# EAGLE design nanopi-black2-shield (EAGLE 9.6.2)
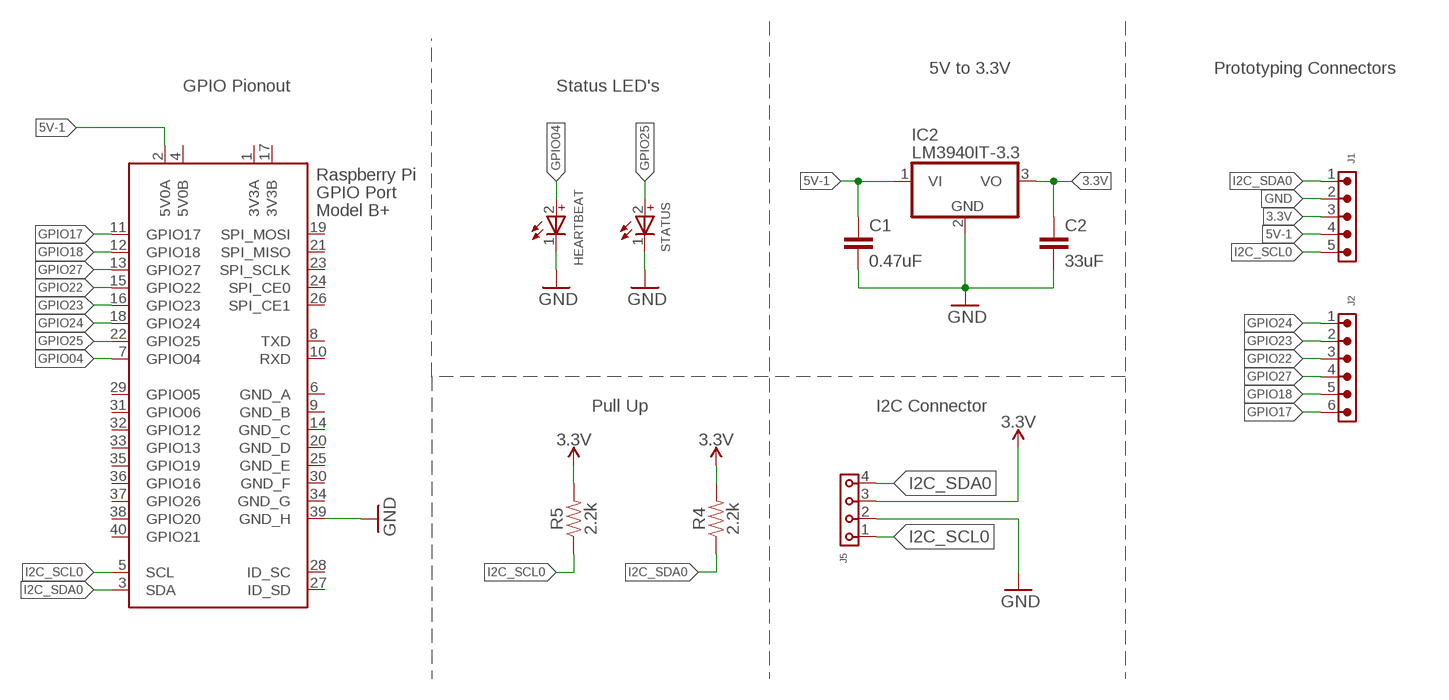
[diagram p0: schematic, sheet 1]

## Parts
C1  0.47uF  1.0UF-0603-16V-10%  [0603]
C2  33uF  C-EUC0805  [C0805]
HEARTBEAT  WL-SMSW_0603_REC_155060RS75300  [WL-SMSW_0603_REC]
IC2  LM3940IT-3.3  7818T  [TO220H]
J1  6130XX11121_61300511121  [61300511121]
J2  6130XX11121_61300611121  [61300611121]
J5  6130XX11821_61300411821  [61300411821]
R4  2.2k  2.2KOHM-0603-1/10W-1%  [0603]
R5  2.2k  2.2KOHM-0603-1/10W-1%  [0603]
STATUS  WL-SMSW_0603_REC_155060GS75300  [WL-SMSW_0603_REC]
X1  RASPI_BOARD_B+#_HDC  [RASPI_BOARD_B+HAT_DF_CF]

## Nets
3.3V [Power]: C2.1 IC2.3(VO) J1.3 J5.3 R4.2 R5.2
5V-1: C1.1 IC2.1(VI) J1.4 X1.2(5V0A)
GND: C1.2 C2.2 HEARTBEAT.1(-) IC2.2(GND) J1.2 J5.2 STATUS.1(-) X1.39(GND_H)
GPIO04: HEARTBEAT.2(+) X1.7(GPIO04)
GPIO17: J2.6 X1.11(GPIO17)
GPIO18: J2.5 X1.12(GPIO18)
GPIO22: J2.3 X1.15(GPIO22)
GPIO23: J2.2 X1.16(GPIO23)
GPIO24: J2.1 X1.18(GPIO24)
GPIO25: STATUS.2(+) X1.22(GPIO25)
GPIO27: J2.4 X1.13(GPIO27)
I2C_SCL0: J1.5 J5.1 R5.1 X1.5(SCL)
I2C_SDA0: J1.1 J5.4 R4.1 X1.3(SDA)
Unconnected: X1.8(TXD) X1.10(RXD) X1.19(SPI_MOSI) X1.21(SPI_MISO) X1.23(SPI_SCLK) X1.24(SPI_CE0) X1.26(SPI_CE1) X1.27(ID_SD) X1.28(ID_SC) X1.29(GPIO05) X1.31(GPIO06) X1.32(GPIO12) X1.33(GPIO13) X1.35(GPIO19) X1.36(GPIO16) X1.37(GPIO26) X1.38(GPIO20) X1.40(GPIO21)

## Notes on the sheet
- 5V to 3.3V | Prototyping Connectors
- GPIO Pionout | Status LED's
- Pull Up | I2C Connector

## Power pins joined to a net without a drawn wire
3V3A: X1.1(3V3A)
3V3B: X1.17(3V3B)
5V0B: X1.4(5V0B)
GND_A: X1.6(GND_A)
GND_B: X1.9(GND_B)
GND_C: X1.14(GND_C)
GND_D: X1.20(GND_D)
GND_E: X1.25(GND_E)
GND_F: X1.30(GND_F)
GND_G: X1.34(GND_G)

## Library data of the parts
C1 = SparkFun-Capacitors:1.0UF: 1µF ceramic capacitors A capacitor is a passive two-terminal electrical component used to store electrical energy temporarily in an electric field.; PROD_ID: CAP-00868; VALUE: 1.0uF
C2 = rcl:C-EU: CAPACITOR, European symbol; SPICEPREFIX: C
HEARTBEAT = 155060GS75300_Eagle_WL-SMSW_rev20b:WL-SMSW_0603_REC: WL-SMSW SMT Mono-color Side View Waterclear Characteristics High reliability Low current requirement No UV/IR radiation Wide viewing angle Excelllent for edge lighting LED displays and backlighting indicators Ideal for miniature applications Compatible with automatic placement equipment Applications Backlighting for LCD Sidelighting applications Indicator and backlighting for telecommunication Backlighting for symbols, switches and dashboards General LED lighting <https://www.we-online.com/catalog/media/o35735v209%20Family_WL-SMSW_1204_155124xx73200A.jpg> Details see: https://www.we-online.com/catalog/en/WL-SMSW/ Updated by Ella Wu, 2020-04-09 2020 (C) Wurth Elektronik; ABSTRAHLWINKEL: 140°; CHIP-TECHNOLOGY: AlInGaP; DATASHEET-URL: https://www.we-online.com/catalog/datasheet/155060RS75300.pdf; EMITTING-COLOR: Red; I-V-TYP: 150mcd; LAMDA-DOM-TYP: 625nm; LAMDA-PEAK-TYP: 625nm; PART-NUMBER: 155060RS75300; V-F-TYP: 2V
IC2 = linear:78*: Positive VOLTAGE REGULATOR Source: http://cache.national.com/ds/LM/LM78L05.pdf http://www.fairchildsemi.com/ds/LM/LM7805.pdf
J1 = 61300621821_Eagle_WR-PHD_rev19a:6130XX11121_61300511121: WR-PHD 2.54 mm THT Pin Header ARTICLE PROPERTIES: Pins:1;​ 2;​ 3;​ 4;​ 5;​ 6;​ 7;​ 8;​ 9;​ 10;​ 12;​ 13;​ 14;​ 15;​ 16;​ 18;​ 20;​ 22;​ 24;​ 25;​ 32;​ 36;​ 40 KIND PROPERTIES: Pitch：2.54 mm Quality Class:3 as per CECC 75 301-802 Rows：Single Gender：Pin Header Type：Straight MATERIAL PROPERTIES: Insulator Material :PBT Insulator Flammability Rating:UL94 V-0 Contact Material:Copper Alloy Contact Plating:Gold Contact Type:Stamped GENERAL INFORMATION Operating Temperature:-40 up to +105 °C Compliance:RoHS ELECTRICAL PROPERTIES: Rated Current:3 A IR 1:3 A Withstanding Voltage:500 V (AC) Contact Resistance:20 mΩ RISO:1000 MΩ CERTIFICATION UL Approval:E323964 PACKAGING PROPERTIES Packaging:Bag <https://katalog.we-online.com/media/images/v2/o33211v209%20Family_BTB_PHD_6130xx11121.jpg> Details see: https://katalog.we-online.com/en/em/PHD_2_54_THT_PIN_HEADER_6130XX11121 Updated by Yingchun,Shan 2019-10-16 2019 (C) Würth Elektronik; DATASHEET-URL: https://katalog.we-online.com/em/datasheet/61300511121.pdf; GENDER: Pin Header; IR: 3A; MATES: WR-PHD 2.54mm Angled Socket Header /SMT Socket Header/Socket Header; PACKAGING: Bag; PART-NUMBER: 61300511121; PINS: 5; ROWS: Single; TYPE: Straight
J2 = 61300621821_Eagle_WR-PHD_rev19a:6130XX11121_61300611121: WR-PHD 2.54 mm THT Pin Header ARTICLE PROPERTIES: Pins:1;​ 2;​ 3;​ 4;​ 5;​ 6;​ 7;​ 8;​ 9;​ 10;​ 12;​ 13;​ 14;​ 15;​ 16;​ 18;​ 20;​ 22;​ 24;​ 25;​ 32;​ 36;​ 40 KIND PROPERTIES: Pitch：2.54 mm Quality Class:3 as per CECC 75 301-802 Rows：Single Gender：Pin Header Type：Straight MATERIAL PROPERTIES: Insulator Material :PBT Insulator Flammability Rating:UL94 V-0 Contact Material:Copper Alloy Contact Plating:Gold Contact Type:Stamped GENERAL INFORMATION Operating Temperature:-40 up to +105 °C Compliance:RoHS ELECTRICAL PROPERTIES: Rated Current:3 A IR 1:3 A Withstanding Voltage:500 V (AC) Contact Resistance:20 mΩ RISO:1000 MΩ CERTIFICATION UL Approval:E323964 PACKAGING PROPERTIES Packaging:Bag <https://katalog.we-online.com/media/images/v2/o33211v209%20Family_BTB_PHD_6130xx11121.jpg> Details see: https://katalog.we-online.com/en/em/PHD_2_54_THT_PIN_HEADER_6130XX11121 Updated by Yingchun,Shan 2019-10-16 2019 (C) Würth Elektronik; DATASHEET-URL: https://katalog.we-online.com/em/datasheet/61300611121.pdf; GENDER: Pin Header; IR: 3A; MATES: WR-PHD 2.54mm Angled Socket Header /SMT Socket Header/Socket Header; PACKAGING: Bag; PART-NUMBER: 61300611121; PINS: 6; ROWS: Single; TYPE: Straight
J5 = 61300411121_Eagle_WR-PHD_rev19a:6130XX11821_61300411821: WR-PHD 2.54 mm Socket Header ARTICLE PROPERTIES: Pins:1;​ 2;​ 3;​ 4;​ 5;​ 6;​ 7;​ 8;​ 9;​ 10;​ 12;​ 13;​ 14;​ 15;​ 16;​ 18;​ 20;​ 22;​ 24;​ 25;​ 32;​ 36;​ 40 KIND PROPERTIES: Pitch：2.54 mm Quality Class:3 as per CECC 75 301-802 Rows：Single Gender：Socket Header;​ Female Type：Straight MATERIAL PROPERTIES: Insulator Material :PBT Insulator Flammability Rating:UL94 V-0 Contact Material:Copper Alloy Contact Plating:Gold Contact Type:Stamped GENERAL INFORMATION Operating Temperature:-40 up to +125 °C Compliance:Lead free / RoHS ELECTRICAL PROPERTIES: Rated Current:3 A IR 1:3 A Withstanding Voltage:500 V (AC) Contact Resistance:20 mΩ RISO:1000 MΩ CERTIFICATION UL Approval:E323964 PACKAGING PROPERTIES Packaging:Tray <https://katalog.we-online.com/media/images/v2/o33218v209%20Family_WR-PHD_613xxx11821.jpg> Details see: https://katalog.we-online.com/en/em/PHD_2_54_SOCKET_HEADER_6130XX11821 Updated by Yingchun,Shan 2019-10-21 2019 (C) Würth Elektronik; DATASHEET-URL: https://katalog.we-online.com/em/datasheet/61300411821.pdf; GENDER: Socket Header; IR: 3A; MATES: WR-PHD 2.54mm SMT Pin Header/THT Angled Pin Header/THT Pin Header; PACKAGING: Tray; PART-NUMBER: 61300411821; PINS: 4; ROWS: Single; TYPE: Straight
R4 R5 = SparkFun-Resistors:2.2KOHM: 2.2kΩ resistor A resistor is a passive two-terminal electrical component that implements electrical resistance as a circuit element. Resistors act to reduce current flow, and, at the same time, act to lower voltage levels within circuits. - Wikipedia; PROD_ID: RES-08272
STATUS = 155060GS75300_Eagle_WL-SMSW_rev20b:WL-SMSW_0603_REC: WL-SMSW SMT Mono-color Side View Waterclear Characteristics High reliability Low current requirement No UV/IR radiation Wide viewing angle Excelllent for edge lighting LED displays and backlighting indicators Ideal for miniature applications Compatible with automatic placement equipment Applications Backlighting for LCD Sidelighting applications Indicator and backlighting for telecommunication Backlighting for symbols, switches and dashboards General LED lighting <https://www.we-online.com/catalog/media/o35735v209%20Family_WL-SMSW_1204_155124xx73200A.jpg> Details see: https://www.we-online.com/catalog/en/WL-SMSW/ Updated by Ella Wu, 2020-04-09 2020 (C) Wurth Elektronik; ABSTRAHLWINKEL: 140°; CHIP-TECHNOLOGY: InGaN; DATASHEET-URL: https://www.we-online.com/catalog/datasheet/155060GS75300.pdf; EMITTING-COLOR: Green; I-V-TYP: 560mcd; LAMDA-DOM-TYP: 525nm; LAMDA-PEAK-TYP: 525nm; PART-NUMBER: 155060GS75300; V-F-TYP: 3.2V
X1 = raspberrypi_bastelstube_v13:RASPI_BOARD_B+#: Raspberry Pi GPIO connector with markings for the outer dimensions of the Raspberry Pi board model B+ with different sets of drill holes or mounting pads All pins connected

## Net classes
1 Power: width 0.305 mm

## Board
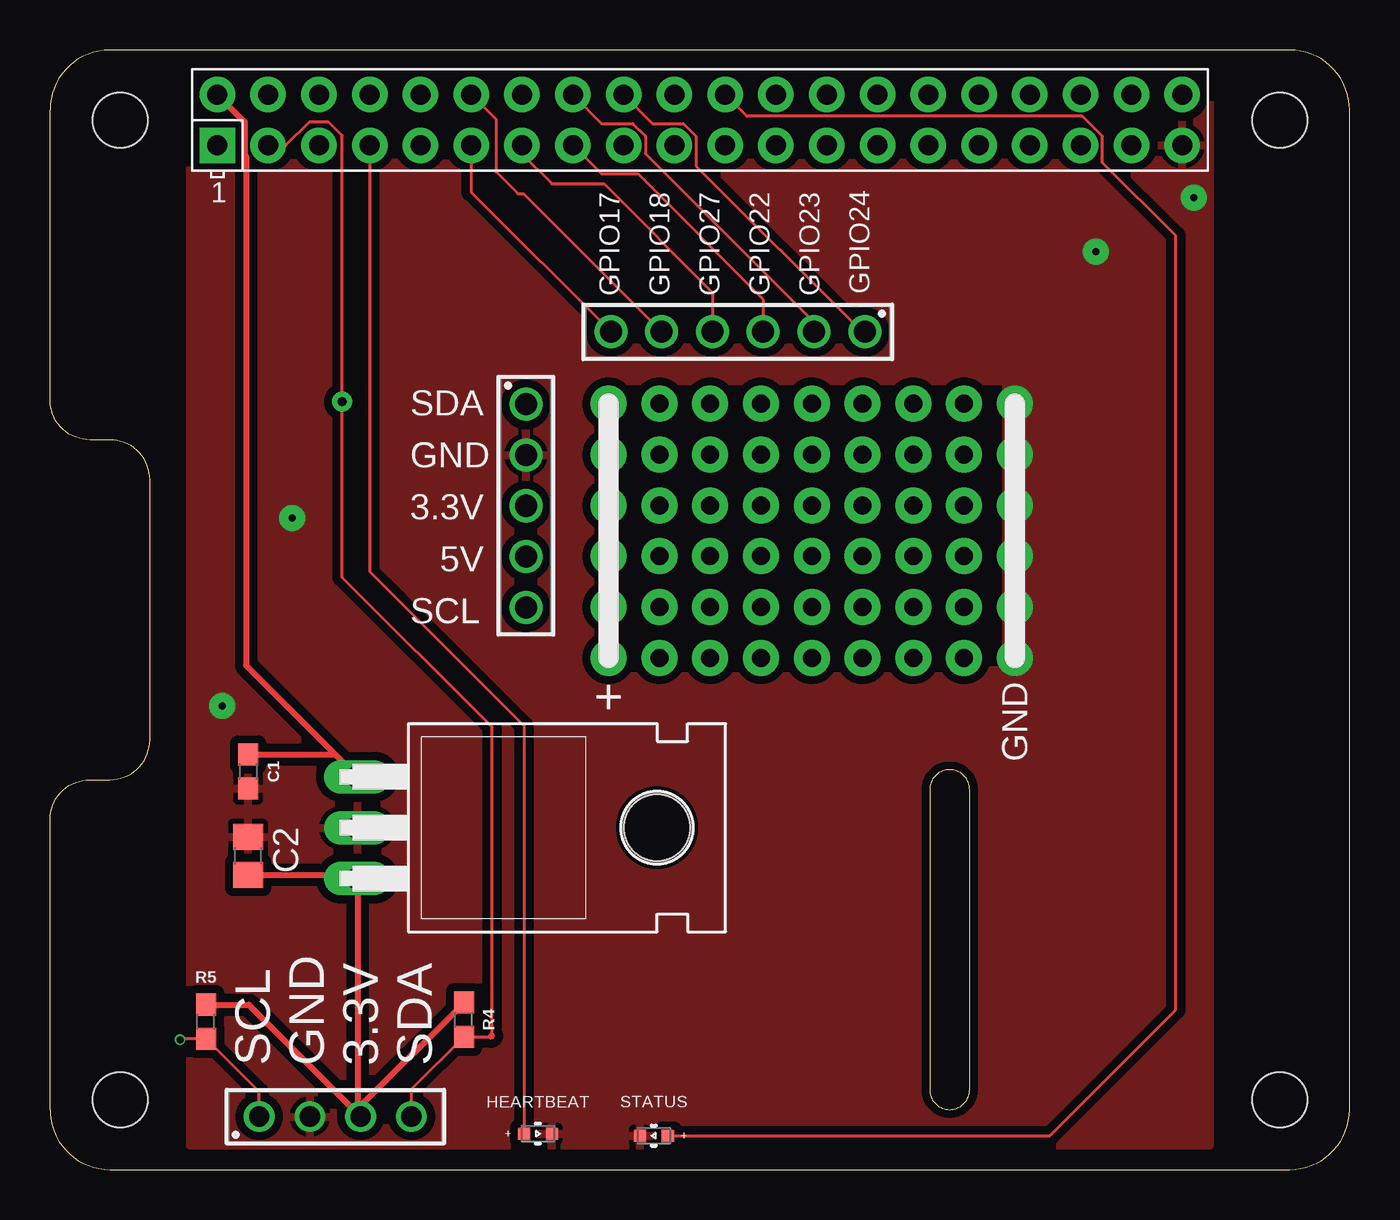
[diagram p1: board, top side]
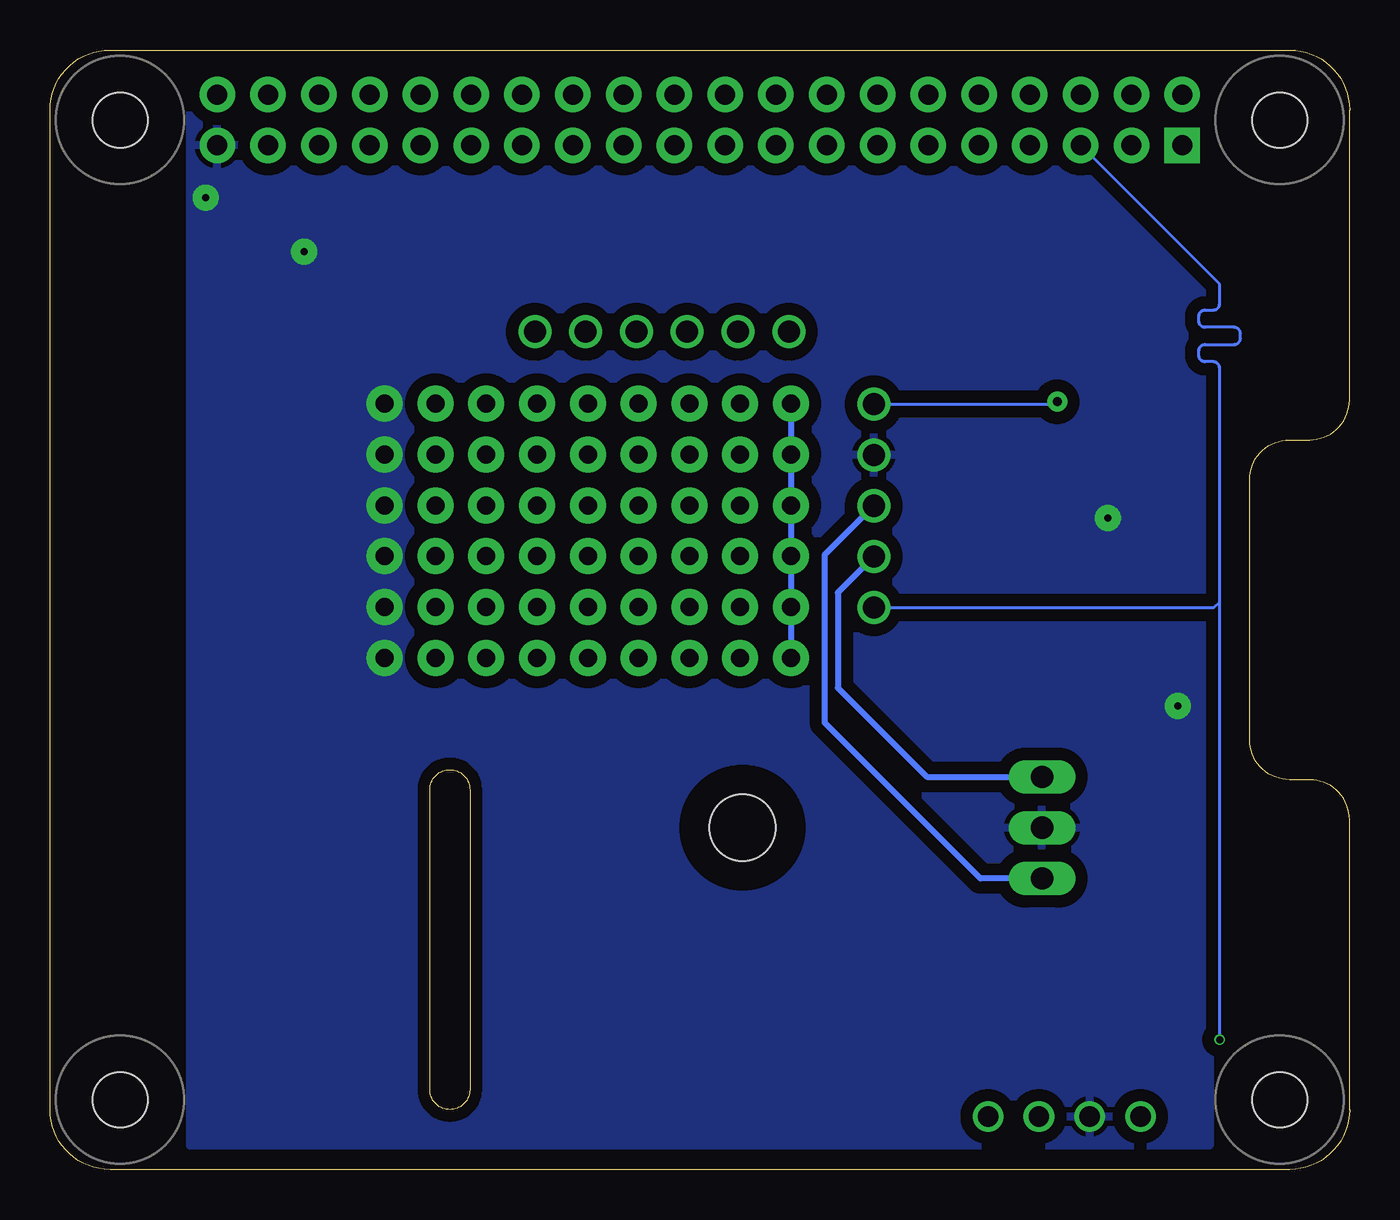
[diagram p2: board, bottom side, seen from below]

Size 65 x 56 mm. Coordinates in mm from the lower left corner, seen from the top.
Copper layers (1*16): Top 0.035559375mm / dielectric 1.6mm / Bottom 0.035559375mm
Design rules "jlcpcb2layer": minimum track width 5mil, minimum drill 12mil, track to track 5mil, track to pad 5mil, pad to pad 5mil, via to via 5mil, smd to smd 5mil, copper to edge 8mil, drill to drill 6mil, minimum pad ring 5mil, minimum via ring 3mil, stop-mask expansion 2.5mil, vias tented up to drill 0mil, thermal gap 10mil

### Footprints (pad centres in the part's own frame; a part is rotated, then mirrored left to right if it is on the bottom)
0603 = smd 1.1 x 1: 1 -0.85,0; 2 0.85,0
C0805 = smd 1.3 x 1.5: 1 -0.95,0; 2 0.95,0
WL-SMSW_0603_REC = smd 0.6 x 0.6: 1 -0.7,0; 2 0.7,0
TO220H = drill 1.118 long: 1 -2.54,-10.16; 2 0,-10.16; 3 2.54,-10.16 | hole 3.302: 0,4.826
61300511121 = drill 1.1: 1 -5.08,0; 2 -2.54,0; 3 0,0; 4 2.54,0; 5 5.08,0
61300611121 = drill 1.1: 1 -6.35,0; 2 -3.81,0; 3 -1.27,0; 4 1.27,0; 5 3.81,0; 6 6.35,0
61300411821 = drill 1.02: 1 -3.81,0; 2 -1.27,0; 3 1.27,0; 4 3.81,0
RASPI_BOARD_B+HAT_DF_CF = drill 1 pad 1.778 square: 1 8.37,51.23 | drill 1 pad 1.778: 2 8.37,53.77; 3 10.91,51.23; 4 10.91,53.77; 5 13.45,51.23; 6 13.45,53.77; 7 15.99,51.23; 8 15.99,53.77; 9 18.53,51.23; 10 18.53,53.77; 11 21.07,51.23; 12 21.07,53.77; 13 23.61,51.23; 14 23.61,53.77; 15 26.15,51.23; 16 26.15,53.77; 17 28.69,51.23; 18 28.69,53.77; 19 31.23,51.23; 20 31.23,53.77; 21 33.77,51.23; 22 33.77,53.77; 23 36.31,51.23; 24 36.31,53.77; 25 38.85,51.23; 26 38.85,53.77; 27 41.39,51.23; 28 41.39,53.77; 29 43.93,51.23; 30 43.93,53.77; 31 46.47,51.23; 32 46.47,53.77; 33 49.01,51.23; 34 49.01,53.77; 35 51.55,51.23; 36 51.55,53.77; 37 54.09,51.23; 38 54.09,53.77; 39 56.63,51.23; 40 56.63,53.77 | hole 2.75: 3.5,3.5; 3.5,52.5; 61.5,3.5; 61.5,52.5

### Placement (x,y rotation side)
C1  9.9,19.91 270 top
C2  9.91,15.69 90 top
HEARTBEAT  24.4,1.8 180 top
IC2  25.54,17.1 270 top
J1  23.8,33.2 270 top
J2  34.4,41.9 180 top
J5  14.27,2.65 0 top
R4  20.7,7.5 90 top
R5  7.8,7.4 90 top
STATUS  30.2,1.7 0 top
X1  0,0 0 top

### Tracks (layer width: path | path; a pad name or v marks a point on that pad's centre or on a via)
3.3V
  Top 0.305: C2.1 15.2,14.74 IC2.3 15.38,2.81 J5.3 | R5.2 9.94,8.25 J5.3 | R4.2 15.54,3.19 J5.3
  Bottom 0.305: IC2.3 18.46,14.56 26.24,22.34 26.24,30.76 J1.3
5V-1
  Top 0.305: X1.2 9.74,52.4 9.74,50.75 9.8,50.69 9.8,25.22 IC2.1 14.26,20.76 C1.1
  Bottom 0.305: J1.4 25.6,28.86 25.6,24.1 21.14,19.64 IC2.1
GND  (via drill 0.35 pad 1.3, 0.9 pad 1.8)
  other vias: 48.26,38.3 48.26,35.76 48.26,33.22 48.26,30.68 48.26,28.14 48.26,25.6 8.6,23.2 12.1,32.6 52.3,45.9 57.2,48.6
  pour Top (isolate 0.406): 7,55.2 58,55.2 58,1.2 7,1.2
  pour Bottom (isolate 0.61): 7,55.2 7,1.2 58,1.2 58,55.2
  cutout Top (isolate 0.305): 28,39.2 28,25.2 47.6,25.2 47.6,39.2
GPIO04
  Top 0.152: X1.7 15.99,29.91 23.7,22.2 HEARTBEAT.2
GPIO17
  Top 0.152: X1.11 21.07,48.88 J2.6
GPIO18
  Top 0.152: X1.12 22.3,52.54 22.3,49.9 23.4,48.8 23.69,48.8 J2.5
GPIO22
  Top 0.152: X1.15 27.58,49.8 29.4,49.8 35.67,43.53 J2.3
GPIO23
  Top 0.152: X1.16 27.6,52.32 29.14,52.32 29.78,51.68 29.78,50.82 38.21,42.39 J2.2
GPIO24
  Top 0.152: X1.18 30.14,52.32 31.68,52.32 32.32,51.68 32.32,50.18 40.6,41.9 J2.1
GPIO25
  Top 0.152: STATUS.2 50,1.7 56.3,8 56.3,46.7 52.64,50.36 52.64,51.68 51.65,52.68 34.86,52.68 X1.22
GPIO27
  Top 0.152: X1.13 23.61,50.79 25.1,49.3 27.7,49.3 33.13,43.87 J2.4
I2C_SCL0  (via drill 0.35)
  Top 0.152: J5.1 10.46,3.89 R5.1 6.55,6.55
  Top 0.305: 6.55,6.55 v6.5,6.5
  Bottom 0.152: v6.5,6.5 6.5,28.4 | 6.5,28.4 6.5,40.09 arc-90 6.81,40.41 7.23,40.41 arc90 7.54,40.72 7.54,40.96 arc90 7.23,41.27 5.77,41.27 arc-90 5.46,41.58 5.46,41.82 arc-90 5.77,42.13 7.23,42.13 arc90 7.54,42.44 7.54,42.68 arc90 7.23,42.99 6.81,42.99 arc-90 6.5,43.3 6.5,44.28 X1.5 | J1.5 6.78,28.12 6.5,28.4
I2C_SDA0  (via drill 0.45 pad 1)
  Top 0.152: J5.4 18.08,4.03 R4.1 22.05,6.65 | X1.3 11.8,51.23 12.97,52.4 13.93,52.4 14.62,51.71 v14.62,38.4 14.62,29.62 22.1,22.14 22.1,6.7
  Top 0.305: 22.05,6.65 22.1,6.7
  Bottom 0.152: v14.62,38.4 14.74,38.28 J1.1
N$1  (via drill 0.9 pad 1.8)
  other vias: 30.48,38.3
N$2  (via drill 0.9 pad 1.8)
  other vias: 33.02,38.3
N$4  (via drill 0.9 pad 1.8)
  other vias: 35.56,38.3
N$5  (via drill 0.9 pad 1.8)
  other vias: 38.1,38.3
N$6  (via drill 0.9 pad 1.8)
  other vias: 40.64,38.3
N$7  (via drill 0.9 pad 1.8)
  other vias: 43.18,38.3
N$9  (via drill 0.9 pad 1.8)
  other vias: 30.48,35.76
N$10  (via drill 0.9 pad 1.8)
  other vias: 33.02,35.76
N$11  (via drill 0.9 pad 1.8)
  other vias: 35.56,35.76
N$12  (via drill 0.9 pad 1.8)
  other vias: 38.1,35.76
N$13  (via drill 0.9 pad 1.8)
  other vias: 40.64,35.76
N$14  (via drill 0.9 pad 1.8)
  other vias: 43.18,35.76
N$15  (via drill 0.9 pad 1.8)
  other vias: 43.18,33.22
N$16  (via drill 0.9 pad 1.8)
  other vias: 40.64,33.22
N$17  (via drill 0.9 pad 1.8)
  other vias: 38.1,33.22
N$18  (via drill 0.9 pad 1.8)
  other vias: 35.56,33.22
N$19  (via drill 0.9 pad 1.8)
  other vias: 33.02,33.22
N$20  (via drill 0.9 pad 1.8)
  other vias: 30.48,33.22
N$23  (via drill 0.9 pad 1.8)
  other vias: 30.48,30.68
N$24  (via drill 0.9 pad 1.8)
  other vias: 33.02,30.68
N$25  (via drill 0.9 pad 1.8)
  other vias: 35.56,30.68
N$26  (via drill 0.9 pad 1.8)
  other vias: 38.1,30.68
N$27  (via drill 0.9 pad 1.8)
  other vias: 40.64,30.68
N$28  (via drill 0.9 pad 1.8)
  other vias: 43.18,30.68
N$29  (via drill 0.9 pad 1.8)
  other vias: 43.18,28.14
N$30  (via drill 0.9 pad 1.8)
  other vias: 40.64,28.14
N$31  (via drill 0.9 pad 1.8)
  other vias: 38.1,28.14
N$32  (via drill 0.9 pad 1.8)
  other vias: 35.56,28.14
N$33  (via drill 0.9 pad 1.8)
  other vias: 33.02,28.14
N$34  (via drill 0.9 pad 1.8)
  other vias: 30.48,28.14
N$37  (via drill 0.9 pad 1.8)
  other vias: 30.48,25.6
N$38  (via drill 0.9 pad 1.8)
  other vias: 33.02,25.6
N$39  (via drill 0.9 pad 1.8)
  other vias: 35.56,25.6
N$40  (via drill 0.9 pad 1.8)
  other vias: 38.1,25.6
N$41  (via drill 0.9 pad 1.8)
  other vias: 40.64,25.6
N$42  (via drill 0.9 pad 1.8)
  other vias: 43.18,25.6
N$43  (via drill 0.9 pad 1.8)
  other vias: 45.72,38.3
N$44  (via drill 0.9 pad 1.8)
  other vias: 45.72,35.76
N$45  (via drill 0.9 pad 1.8)
  other vias: 45.72,33.22
N$46  (via drill 0.9 pad 1.8)
  other vias: 45.72,30.68
N$47  (via drill 0.9 pad 1.8)
  other vias: 45.72,28.14
N$48  (via drill 0.9 pad 1.8)
  other vias: 45.72,25.6
PLUS  (via drill 0.9 pad 1.8)
  Bottom 0.305: v27.94,38.3 v27.94,35.76 v27.94,33.22 v27.94,30.68 v27.94,28.14 v27.94,25.6

### Text on the board
tPlace: GPIO17 | GPIO18 | GPIO27 | GPIO22 | GPIO23 | GPIO24 | SDA | GND | 3.3V | 5V | SCL | + | GND | SCL | GND | 3.3V | SDA